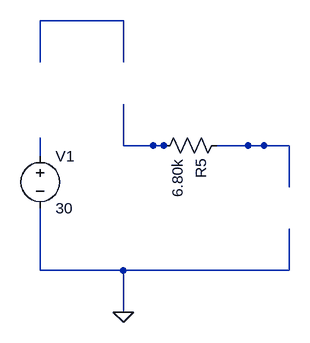
[diagram p0: schematic pannel4.asc]
pannel4.asc, the LTspice schematic file:
Version 4
SHEET 1 880 680
WIRE 528 448 601 448
WIRE 430 448 446 448
SYMBOL res 544 432 R90
SYMATTR InstName R5
SYMATTR Value 6.80k
FLAG 384 704 0
WIRE 256 464 256 436
WIRE 256 576 256 544
SYMBOL voltage 256 448 R0
SYMATTR InstName V1
SYMATTR Value 30
WIRE 576 448 640 448
WIRE 640 448 640 512
WIRE 576 640 640 640
WIRE 640 576 640 640
WIRE 256 576 256 640
WIRE 256 640 320 640
WIRE 256 256 320 256
WIRE 256 256 256 320
WIRE 384 384 384 448
WIRE 384 448 448 448
WIRE 320 256 384 256
WIRE 384 256 384 320
WIRE 320 640 384 640
WIRE 384 640 448 640
WIRE 384 640 384 704
WIRE 512 640 576 640
WIRE 448 640 512 640

The netlist it stands for:
* pannel4.asc
R5 N001 N002 6.80k
V1 N003 0 30
.backanno
.end